# EAGLE design analog_v2 (EAGLE 6.3)
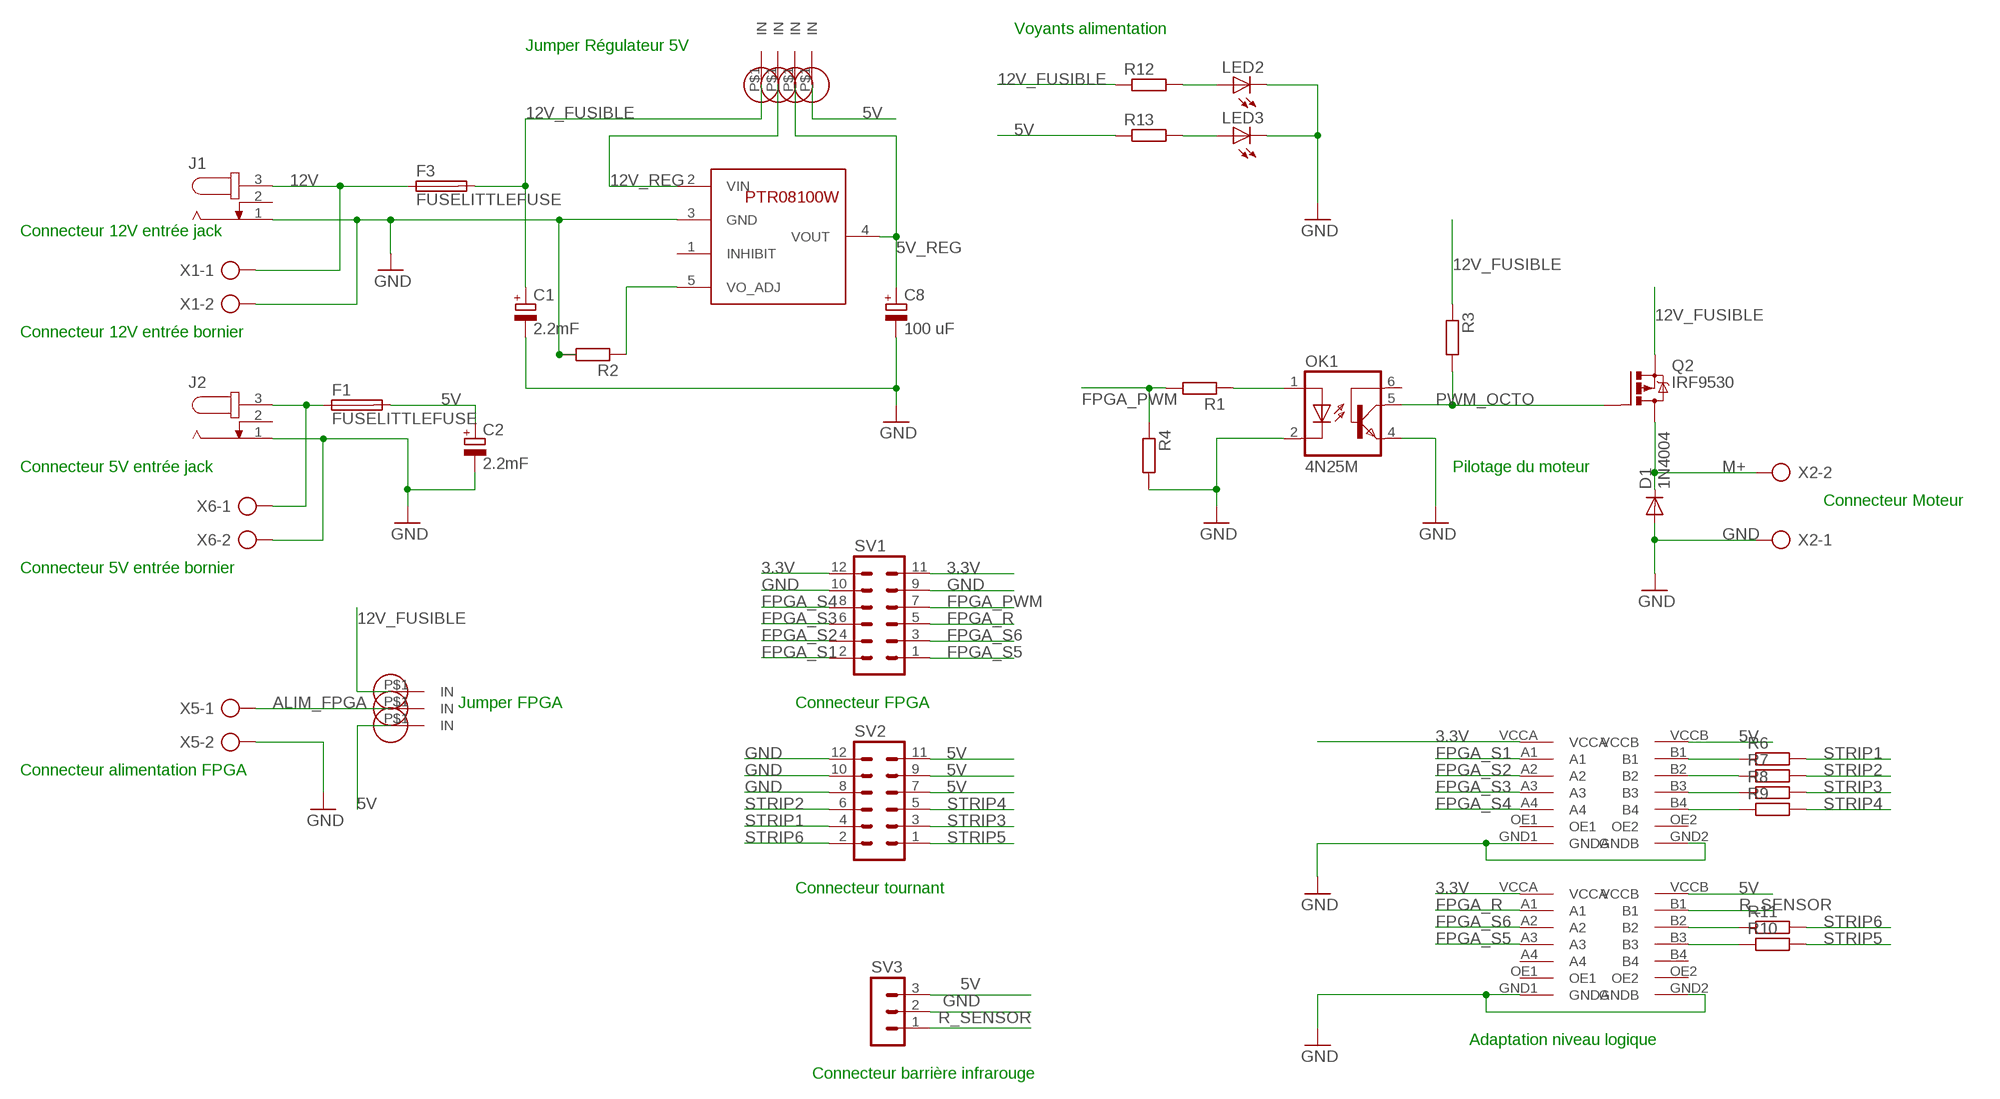
[diagram p0: schematic, sheet 1]

## Parts
C1  2.2mF  CPOL-EUE7.5-16  [E7,5-16]
C2  2.2mF  CPOL-EUE7.5-16  [E7,5-16]
C8  100 uF  CPOL-EUE2.5-7  [E2,5-7]
D1  1N4004  [DO41-10]
F1  FUSELITTLEFUSE  [LITTLEFUSE]
F3  FUSELITTLEFUSE  [LITTLEFUSE]
J1  JACK-PLUG1  [SPC4078]
J2  JACK-PLUG1  [SPC4078]
LED2  LED5MM  [LED5MM]
LED3  LED5MM  [LED5MM]
OK1  4N25M  [DIL06]
Q2  IRF9530  [TO220BV]
R1  R-EU_0207/10  [0207/10]
R2  R-EU_0207/10  [0207/10]
R3  R-EU_0207/10  [0207/10]
R4  R-EU_0207/10  [0207/10]
R6  R-EU_0207/10  [0207/10]
R7  R-EU_0207/10  [0207/10]
R8  R-EU_0207/10  [0207/10]
R9  R-EU_0207/10  [0207/10]
R10  R-EU_0207/10  [0207/10]
R11  R-EU_0207/10  [0207/10]
R12  R-EU_0207/10  [0207/10]
R13  R-EU_0207/10  [0207/10]
SV1  MA06-2  [MA06-2]
SV2  MA06-2  [MA06-2]
SV3  MA03-1  [MA03-1]
U2  PTR08100W  [PTR08100W]
U$1  TXB0104  [TXB0104]
U$2  TXB0104  [TXB0104]
U$3  JUMPER_CONNECTOR  [JUMPER_CONNECTOR]
U$4  JUMPER_CONNECTOR  [JUMPER_CONNECTOR]
U$5  JUMPER_CONNECTOR  [JUMPER_CONNECTOR]
U$6  JUMPER_CONNECTOR  [JUMPER_CONNECTOR]
U$7  JUMPER_CONNECTOR  [JUMPER_CONNECTOR]
U$10  JUMPER_CONNECTOR  [JUMPER_CONNECTOR]
U$12  JUMPER_CONNECTOR  [JUMPER_CONNECTOR]
X1  AK500/2  [AK500/2]
X2  AK500/2  [AK500/2]
X5  AK500/2  [AK500/2]
X6  AK500/2  [AK500/2]

## Nets
3.3V: SV1.11 SV1.12 U$1.VCCA U$2.VCCA
5V: C2.+ F1.2 R13.1 SV2.7 SV2.9 SV2.11 SV3.3 U$1.VCCB U$2.VCCB U$5.P$1(IN) U$10.P$1(IN)
5V_IN: F1.1 J2.3 X6.1
5V_REG: C8.+ U2.4(VOUT) U$12.P$1(IN)
12V: F3.1 J1.3 X1.1
12V_FUSIBLE: C1.+ F3.2 Q2.S R3.1 R12.1 U$3.P$1(IN) U$6.P$1(IN)
12V_REG: U2.2(VIN) U$7.P$1(IN)
ALIM_FPGA: U$4.P$1(IN) X5.1
FPGA_PWM: R1.2 R4.1 SV1.7
FPGA_R: SV1.5 U$2.A1
FPGA_S1: SV1.2 U$1.A1
FPGA_S2: SV1.4 U$1.A2
FPGA_S3: SV1.6 U$1.A3
FPGA_S4: SV1.8 U$1.A4
FPGA_S5: SV1.1 U$2.A3
FPGA_S6: SV1.3 U$2.A2
GND: C1.- C2.- C8.- D1.A J1.1 J2.1 LED2.K(C) LED3.K(C) OK1.2(C) OK1.4(EMI) R2.2 R4.2 SV1.9 SV1.10 SV2.8 SV2.10 SV2.12 SV3.2 U2.3(GND) U$1.GND1(GNDA) U$1.GND2(GNDB) U$2.GND1(GNDA) U$2.GND2(GNDB) X1.2 X2.1 X5.2 X6.2
M+: D1.C Q2.D X2.2
PWM_OCTO: OK1.5(COL) Q2.G R3.2
R_SENSOR: SV3.1 U$2.B1
R_STRIP_1: R6.1 U$1.B1
R_STRIP_2: R7.1 U$1.B2
R_STRIP_3: R8.1 U$1.B3
R_STRIP_4: R9.1 U$1.B4
R_STRIP_5: R10.1 U$2.B3
R_STRIP_6: R11.1 U$2.B2
RES_LED_5V: LED3.A R13.2
RES_LED_12V: LED2.A R12.2
RES_OCTO: OK1.1(A) R1.1
STRIP1: R6.2 SV2.4
STRIP2: R7.2 SV2.6
STRIP3: R8.2 SV2.3
STRIP4: R9.2 SV2.5
STRIP5: R10.2 SV2.1
STRIP6: R11.2 SV2.2
VO_ADJ: R2.1 U2.5(VO_ADJ)
Unconnected: J1.2 J2.2 OK1.6(BAS) U2.1(INHIBIT) U$1.OE1 U$1.OE2 U$2.A4 U$2.B4 U$2.OE1 U$2.OE2

## Notes on the sheet
- Voyants alimentation
- Jumper Régulateur 5V
- Connecteur 12V entrée jack
- Connecteur 12V entrée bornier
- Connecteur 5V entrée jack | Pilotage du moteur
- Connecteur Moteur
- Connecteur 5V entrée bornier
- Jumper FPGA | Connecteur FPGA
- Connecteur alimentation FPGA
- Connecteur tournant
- Adaptation niveau logique
- Connecteur barrière infrarouge

## Library data of the parts
C1 C2 C8 = rcl:CPOL-EU: POLARIZED CAPACITOR, European symbol
D1 = diode:1N4004: DIODE general purpose rectifier, 1 A
F1 F3 = fuse:FUSE: Fuse; OC_FARNELL: unknown; OC_NEWARK: unknown
J1 J2 = con-jack:JACK-PLUG: DC POWER JACK Power Jack, DC, Right Angle, Through Hole, Rated 5A at 16VDC, PC Terminals Distributor: Farnell (www.Farnell.de) Drawing: 84N1161.pdf / 84N1162.pdf Manufacturer: SPC Technology (www.spctechnology.com) Type: SPC4077 / SPC 4078; OC_FARNELL: unknown; OC_NEWARK: unknown
LED2 LED3 = led:LED: LED OSRAM: - CHIPLED LG R971, LG N971, LY N971, LG Q971, LY Q971, LO R971, LY R971 LH N974, LH R974 LS Q976, LO Q976, LY Q976 LO Q996 - Hyper CHIPLED LW Q18S LB Q993, LB Q99A, LB R99A - SideLED LS A670, LO A670, LY A670, LG A670, LP A670 LB A673, LV A673, LT A673, LW A673 LH A674 LY A675 LS A676, LA A676, LO A676, LY A676, LW A676 LS A679, LY A679, LG A679 - Hyper Micro SIDELED® LS Y876, LA Y876, LO Y876, LY Y876 LT Y87S - SmartLED LW L88C, LW L88S LB L89C, LB L89S, LG L890 LS L89K, LO L89K, LY L89K LS L896, LA L896, LO L896, LY L896 - TOPLED LS T670, LO T670, LY T670, LG T670, LP T670 LSG T670, LSP T670, LSY T670, LOP T670, LYG T670 LG T671, LOG T671, LSG T671 LB T673, LV T673, LT T673, LW T673 LH T674 LS T676, LA T676, LO T676, LY T676, LB T676, LH T676, LSB T676, LW T676 LB T67C, LV T67C, LT T67C, LS T67K, LO T67K, LY T67K, LW E67C LS E67B, LA E67B, LO E67B, LY E67B, LB E67C, LV E67C, LT E67C LW T67C LS T679, LY T679, LG T679 LS T770, LO T770, LY T770, LG T770, LP T770 LB T773, LV T773, LT T773, LW T773 LH T774 LS E675, LA E675, LY E675, LS T675 LS T776, LA T776, LO T776, LY T776, LB T776 LHGB T686 LT T68C, LB T68C - Hyper Mini TOPLED® LB M676 - Mini TOPLED Santana® LG M470 LS M47K, LO M47K, LY M47K Source: http://www.osram.convergy.de LUXEON: - LUMILED® LXK2-PW12-R00, LXK2-PW12-S00, LXK2-PW14-U00, LXK2-PW14-V00 LXK2-PM12-R00, LXK2-PM12-S00, LXK2-PM14-U00 LXK2-PE12-Q00, LXK2-PE12-R00, LXK2-PE12-S00, LXK2-PE14-T00, LXK2-PE14-U00 LXK2-PB12-K00, LXK2-PB12-L00, LXK2-PB12-M00, LXK2-PB14-N00, LXK2-PB14-P00, LXK2-PB14-Q00 LXK2-PR12-L00, LXK2-PR12-M00, LXK2-PR14-Q00, LXK2-PR14-R00 LXK2-PD12-Q00, LXK2-PD12-R00, LXK2-PD12-S00 LXK2-PH12-R00, LXK2-PH12-S00 LXK2-PL12-P00, LXK2-PL12-Q00, LXK2-PL12-R00 Source: www.luxeon.com KINGBRIGHT: KA-3528ASYC Source: www.kingbright.com
OK1 = optocoupler:4N*?M: General Purpose 6-Pin Phototransistor Optocouplers Source: http://www.fairchildsemi.com/ds/4N/4N35-M.pdf; MPN: 4N25-M; OC_FARNELL: 1021349; OC_NEWARK: 98K9084
Q2 = transistor-power:IRF9530: P-CHANNEL HEXFET POWER-MOS-FET Source: http://www.irf.com/product-info/datasheets/data/irf9530.pdf
R1-R4 R6-R13 = rcl:R-EU_: RESISTOR, European symbol
SV1 SV2 = con-lstb:MA06-2: PIN HEADER; OC_FARNELL: unknown; OC_NEWARK: unknown
SV3 = con-lstb:MA03-1: PIN HEADER; OC_FARNELL: unknown; OC_NEWARK: unknown
U2 = perso:PTR08100W
U$1 U$2 = perso:TXB0104
U$3-U$7 U$10 U$12 = perso:JUMPER_CONNECTOR
X1 X2 X5 X6 = con-ptr500:AK500/2: CONNECTOR; OC_FARNELL: unknown; OC_NEWARK: unknown

## Board
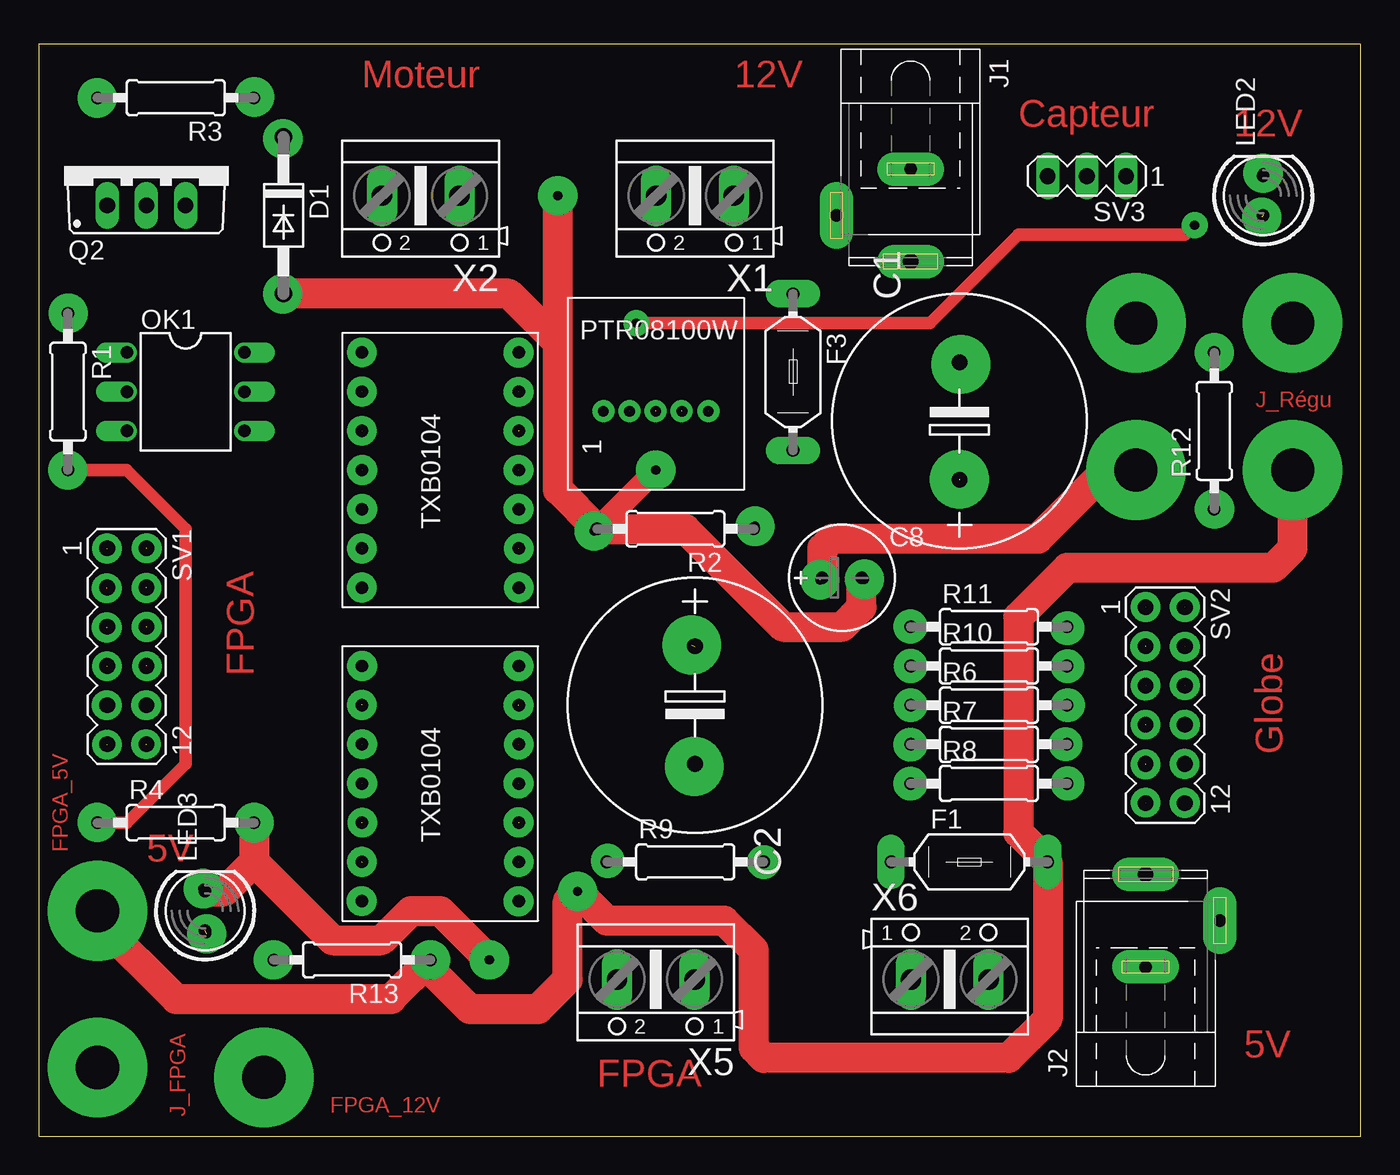
[diagram p1: board, top side]
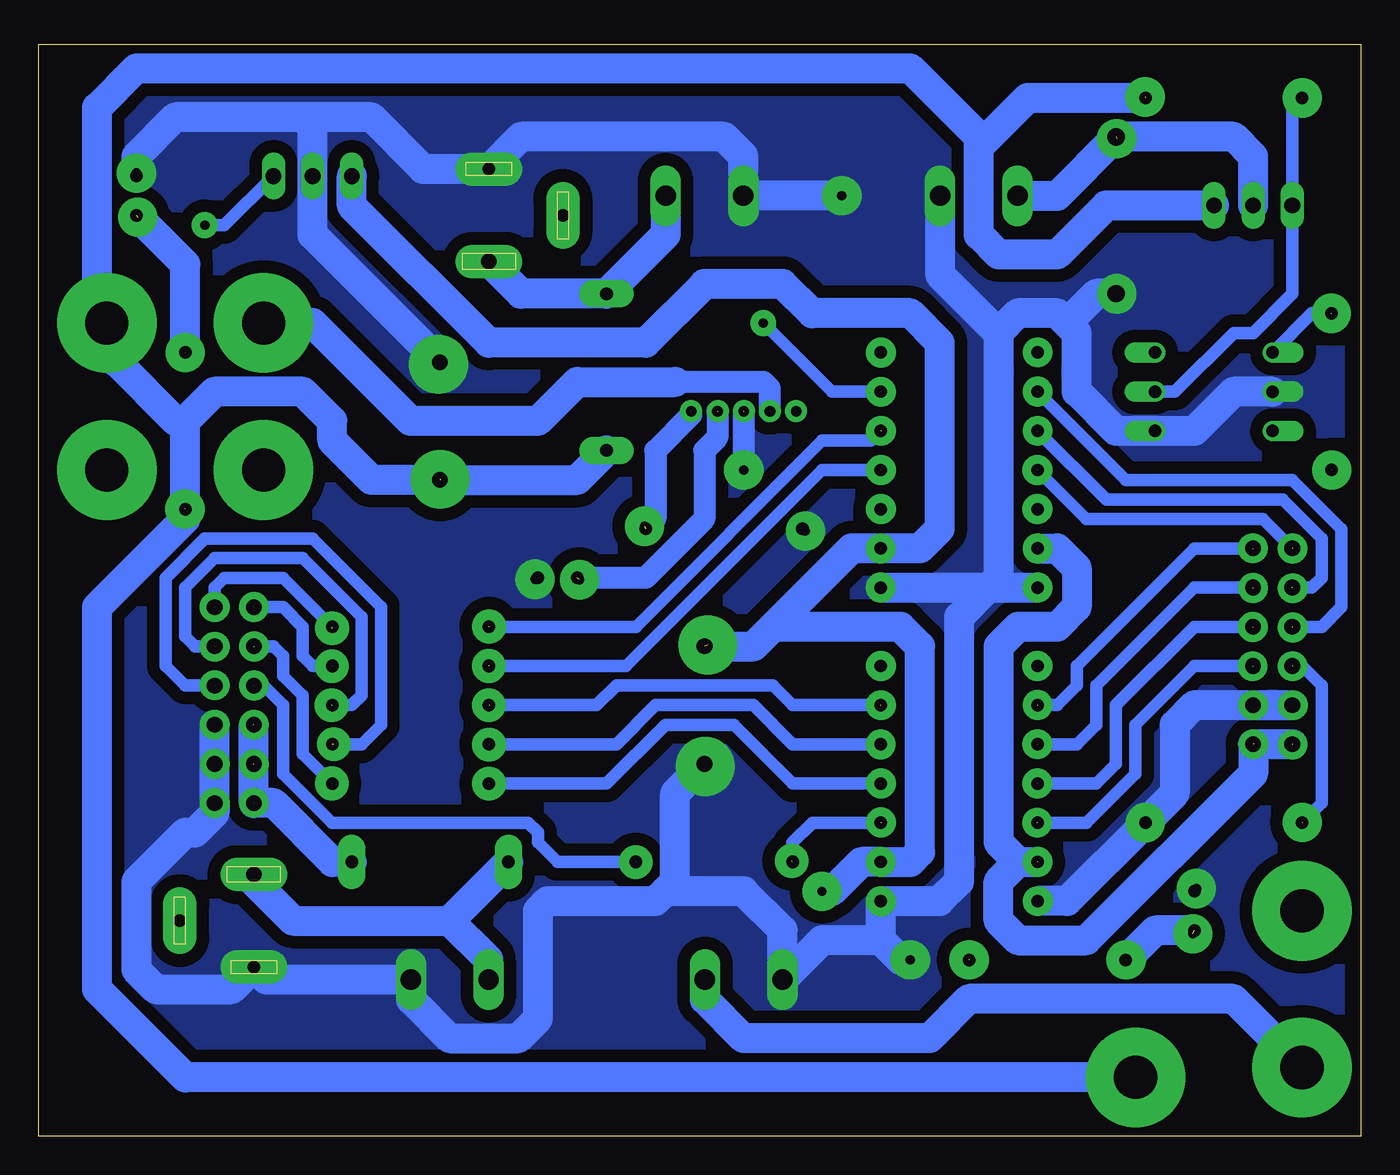
[diagram p2: board, bottom side, seen from below]

Size 85.7 x 70.79 mm. Coordinates in mm from the lower left corner, seen from the top.
Outline: 0,0 85.7,0 85.7,70.79 0,70.79 0,0
Copper layers (1*16): Top 0.035mm / dielectric 1.5mm / Bottom 0.035mm
Design rules "default": minimum track width 10mil, minimum drill 24mil, track to track 8mil, track to pad 8mil, pad to pad 8mil, via to via 8mil, smd to smd 8mil, copper to edge 40mil, drill to drill 8mil, minimum pad ring 10mil, minimum via ring 8mil, stop-mask expansion 4mil, vias tented up to drill 0mil, thermal gap 10mil

### Footprints (pad centres in the part's own frame; a part is rotated, then mirrored left to right if it is on the bottom)
E7,5-16 = drill 1.016 pad 3.15: + -3.81,0 | drill 1.016 pad 3.15 octagon: - 3.81,0
E2,5-7 = drill 0.813 pad 1.6: + -1.27,0 | drill 0.813 pad 1.6 octagon: - 1.27,0
DO41-10 = drill 1.118: A 5.08,0; C -5.08,0
LITTLEFUSE = drill 0.813 pad 1.778 long: 1 -5.08,0; 2 5.08,0
SPC4078 = drill 0.8 pad 2.184 long: 1 -3,0; 2 0,-4.8 | drill 1 pad 2.184 long: 3 3,0
LED5MM = drill 0.813 octagon: A -1.27,0; K 1.27,0
DIL06 = drill 0.813 offset: 1 -2.54,-3.81; 2 0,-3.81; 3 2.54,-3.81; 4 2.54,3.81; 5 0,3.81; 6 -2.54,3.81
TO220BV = drill 1.016 long: D 0,-2.54; G -2.54,-2.54; S 2.54,-2.54
0207/10 = drill 0.813 octagon: 1 -5.08,0; 2 5.08,0
MA06-2 = drill 1.016 octagon: 1 -6.35,-1.27; 2 -6.35,1.27; 3 -3.81,-1.27; 4 -3.81,1.27; 5 -1.27,-1.27; 6 -1.27,1.27; 7 1.27,-1.27; 8 1.27,1.27; 9 3.81,-1.27; 10 3.81,1.27; 11 6.35,-1.27; 12 6.35,1.27
MA03-1 = drill 1.016 long: 1 -2.54,0; 2 0,0; 3 2.54,0
PTR08100W = drill 0.7: 1 0,-3.4; 2 0,-1.7; 3 0,0; 4 0,1.7; 5 0,3.4
TXB0104 = drill 0.8: A1 -5.08,5.08; A2 -5.08,2.54; A3 -5.08,0; A4 -5.08,-2.54; B1 5.08,5.08; B2 5.08,2.54; B3 5.08,0; B4 5.08,-2.54; GND1 -5.08,-7.62; GND2 5.08,-7.62; OE1 -5.08,7.62; OE2 5.08,7.62; VCCA -5.08,-5.08; VCCB 5.08,-5.08
JUMPER_CONNECTOR = drill 2.8 pad 6.452: P$1 0,0
AK500/2 = drill 1.321 long: 1 -2.515,0; 2 2.515,0

### Placement (x,y rotation side)
C1  59.69,46.36 90 top
C2  42.55,27.94 270 top
C8  52.07,36.2 0 top
D1  15.88,59.69 270 top
F1  60.32,17.78 0 top
F3  48.89,49.53 270 top
J1  56.52,59.69 270 top
J2  71.75,13.97 90 top
LED2  79.38,60.96 90 top
LED3  10.79,14.61 90 top
OK1  9.53,48.26 270 top
Q2  6.99,62.87 0 top
R1  1.91,48.26 270 top
R2  41.27,39.37 180 top
R3  8.89,67.31 180 top
R4  8.89,20.32 0 top
R6  61.59,27.94 0 top
R7  61.59,25.4 0 top
R8  61.59,22.86 0 top
R9  41.91,17.78 0 top
R10  61.59,30.48 0 top
R11  61.59,33.02 0 top
R12  76.2,45.72 90 top
R13  20.32,11.43 180 top
SV1  5.71,31.75 270 top
SV2  73.03,27.94 270 top
SV3  67.94,62.23 180 top
U2  40,46.99 270 top
U$1  26.04,22.86 0 top
U$2  26.04,43.18 0 top
U$3  14.61,3.81 0 top
U$4  3.81,4.45 0 top
U$5  3.81,14.61 0 top
U$6  81.28,52.71 0 top
U$7  71.12,52.71 0 top
U$10  81.28,43.18 0 top
U$12  71.12,43.18 0 top
X1  42.55,60.96 180 top
X2  24.77,60.96 180 top
X5  40,10.16 180 top
X6  59.05,10.16 0 top

### Tracks (layer width: path | path; a pad name or v marks a point on that pad's centre or on a via)
3.3V  (via drill 0.6 pad 1.93)  (4 unrouted)
  Bottom 1.93: 22.22,17.78 23.49,16.51 23.49,13.97 22.22,12.7 17.78,12.7 6.99,23.49 SV1.12 SV1.11 | 22.22,17.78 U$1.VCCA | U$2.VCCA 19.68,38.1 18.41,36.83 18.41,34.29 19.68,33.02 22.22,33.02 23.49,31.75 23.49,19.05 22.22,17.78
  other vias: 20.95,17.77 20.96,38.1 4.43,25.38 6.96,25.41
5V  (via drill 0.6 pad 1.93, 0.6 pad 2.54, 0.6 pad 3.81)  (7 unrouted)
  Top 1.93: U$5.P$1 3.81,13.97 8.89,8.89 22.86,8.89 R13.1 25.4,10.79 27.94,8.26 32.38,8.26 34.29,10.16 34.29,15.24 v34.92,15.88 36.83,13.97 44.45,13.97 46.35,12.07 46.35,5.71 46.99,5.08 62.86,5.08 65.41,7.62 F1.2 63.5,19.68 63.5,33.66 66.67,36.83 80.01,36.83 81.28,38.1 U$10.P$1
  Bottom 1.93: C2.+ 39.37,31.75 38.1,33.02 | 38.1,33.02 33.02,38.1 U$2.VCCB 28.57,38.1 27.3,39.37 27.3,51.44 29.21,53.34 35.56,53.34 37.46,55.25 42.55,55.25 46.35,51.44 56.52,51.44 65.41,60.33 SV3.3 | SV2.7 SV2.9 SV2.11 70.48,21.59 66.67,17.78 F1.2 | v34.92,15.88 34.29,15.88 32.38,17.78 U$1.VCCB 29.21,17.78 28.57,18.41 28.57,31.75 29.84,33.02 38.1,33.02
  other vias: 25.39,11.43 31.12,17.78 42.33,31.83 31.12,38.09 71.75,21.62 71.75,24.11 71.75,26.67
5V_IN
  Bottom 1.93: J2.3 71.75,16.51 69.22,13.97 59.05,13.97 | 59.05,13.97 F1.1 | X6.1 56.54,11.46 59.05,13.97
5V_REG  (via drill 0.6 pad 1.42, 0.6 pad 2.54)  (2 unrouted)
  Top 1.93: C8.+ 50.8,38.1 51.44,38.73 64.77,38.73 69.22,43.18 U$12.P$1
  Bottom 1.422: U2.4 41.7,45.29 42.55,44.45 42.55,40.01 46.35,36.2 C8.+
  other vias: 41.68,47.01 50.65,36.07
12V
  Bottom 1.93: X1.1 45.06,58.45 F3.1 54.44,54.61 J1.3
12V_FUSIBLE  (via drill 0.6 pad 2.54, 0.6 pad 3.81)  (3 unrouted)
  Bottom 1.93: F3.2 50.8,42.55 C1.+ 64.14,42.55 66.67,45.09 66.67,46.36 68.58,48.26 74.3,48.26 76.2,46.36 | Q2.S 16.51,60.33 19.68,57.15 23.49,57.15 24.77,58.42 24.77,64.14 | 24.77,64.14 21.59,67.31 R3.1 | 24.77,64.14 24.77,64.77 29.21,69.22 79.38,69.22 81.91,66.67 81.91,53.34 U$6.P$1 80.64,52.07 80.64,50.16 76.83,46.36 76.2,46.36 | 76.2,46.36 R12.1 76.2,40.01 81.91,34.29 81.91,9.53 76.2,3.81 U$3.P$1
  other vias: 59.68,42.58 76.22,40.66 13.99,67.37
12V_REG  (via drill 0.6 pad 1.42)  (1 unrouted)
  Bottom 1.422: U2.2 38.3,48.47 38.73,48.9 44.45,48.9
  Bottom 1.93: 44.45,48.9 50.8,48.9 53.34,46.36 61.59,46.36 67.94,52.71 U$7.P$1
  other vias: 38.32,46.99
ALIM_FPGA
  Bottom 1.93: X5.1 42.52,8.87 40,6.35 27.94,6.35 25.4,8.89 8.26,8.89 U$4.P$1
FPGA_PWM  (via drill 0.6 pad 1.93, 0.6 pad 2.54)  (3 unrouted)
  Top 0.813: R1.2 5.71,43.18 9.53,39.37 9.53,24.13 5.71,20.32 R4.1
  Bottom 0.813: SV1.7 3.81,30.48 2.54,29.21 2.54,21.6 v3.8,20.33
  other vias: 1.89,43.17 4.43,30.46
FPGA_R  (via drill 0.6 pad 1.93)  (2 unrouted)
  Bottom 0.813: U$2.A1 15.24,42.55 4.44,42.55 1.27,39.37 1.27,34.29 2.54,33.02 SV1.5
  other vias: 20.96,48.27 4.42,32.98
FPGA_S1  (via drill 0.6 pad 1.93)  (2 unrouted)
  Bottom 0.813: U$1.A1 19.68,27.94 18.41,29.21 18.41,30.48 10.79,38.1 SV1.2
  other vias: 20.95,27.95 7,38.11
FPGA_S2  (via drill 0.6 pad 1.93)  (2 unrouted)
  Bottom 0.813: U$1.A2 18.41,25.4 17.14,26.67 17.14,29.21 10.79,35.56 SV1.4
  other vias: 20.97,25.41 7,35.54
FPGA_S3  (via drill 0.6 pad 1.93)  (2 unrouted)
  Bottom 0.813: U$1.A3 17.14,22.86 15.88,24.13 15.88,27.94 10.79,33.02 SV1.6
  other vias: 20.98,22.87 7,33
FPGA_S4  (via drill 0.6 pad 1.93)  (2 unrouted)
  Bottom 0.813: U$1.A4 17.78,20.32 14.61,23.49 14.61,26.67 10.79,30.48 SV1.8
  other vias: 20.98,20.32 7.02,30.46
FPGA_S5  (via drill 0.6 pad 1.93)  (2 unrouted)
  Bottom 0.813: U$2.A3 17.78,40.01 6.35,40.01 SV1.1
  other vias: 20.96,43.18 4.43,38.08
FPGA_S6  (via drill 0.6 pad 1.93)  (2 unrouted)
  Bottom 0.813: U$2.A2 16.51,41.28 5.08,41.28 2.54,38.73 2.54,36.2 3.17,35.56 SV1.3
  other vias: 20.96,45.72 4.42,35.52
GND  (via drill 0.6 pad 1.42, 0.6 pad 1.93, 0.6 pad 2.54, 0.6 pad 3.81)  (1 unrouted)
  Top 1.422: v40,43.18 R2.2
  Top 1.93: 33.66,51.44 33.66,41.91 R2.2 41.91,39.37 48.26,33.02 52.07,33.02 53.34,34.29 C8.- | 33.66,51.44 30.48,54.61 D1.A | v29.21,11.43 26.04,14.61 24.13,14.61 22.22,12.7 19.05,12.7 13.97,17.78 | 33.66,51.44 v33.66,60.96 | R4.2 13.97,17.78 | LED3.K 12.07,15.88 13.97,17.78
  Bottom 1.422: U2.3 v40,43.18
  Bottom 1.93: OK1.2 8.26,48.26 10.79,45.72 OK1.4 15.88,45.72 18.41,48.26 18.41,52.07 19.05,52.71 | 19.05,52.71 19.68,53.34 22.22,53.34 23.49,52.07 | 22.22,35.56 U$2.GND1 24.13,35.56 | D1.A 17.14,54.61 19.05,52.71 | X2.1 27.28,55.86 23.49,52.07 | X1.2 40.03,63.53 41.27,64.77 54.44,64.77 J1.1 60.78,62.69 64.14,66.04 68.58,66.04 | SV2.8 SV2.10 SV2.12 74.3,20.95 75.56,19.68 76.2,19.68 79.38,16.51 79.38,10.79 78.11,9.53 73.2,9.53 J2.1 70.94,10.16 X6.2 61.57,8.87 59.05,6.35 54.61,6.35 53.34,7.62 53.34,14.61 52.7,15.24 45.72,15.24 45.09,15.88 | 45.09,15.88 44.45,16.51 44.45,22.22 C2.- | U$2.GND2 24.13,35.56 | 24.13,35.56 26.04,33.66 26.04,16.51 27.3,15.24 U$1.GND2 31.12,12.7 | 23.49,52.07 23.49,36.2 24.13,35.56 | 40,60.94 X1.2 | 45.09,15.88 40,15.88 37.49,13.36 X5.2 37.46,10.16 34.92,12.7 31.12,12.7 | v29.21,11.43 29.84,11.43 31.12,12.7 | 68.58,66.04 76.83,66.04 79.38,63.5 LED2.K | v33.66,60.96 X1.2 | 68.58,66.04 67.94,65.41 SV3.2 67.94,58.42 C1.- | U$1.GND1 19.05,15.24 R4.2 12.07,22.22 12.07,26.67 10.79,27.94 SV1.10 SV1.9
  other vias: 13.98,20.33 10.66,16.04 20.93,15.24 20.95,35.56 31.12,35.58 15.82,54.59 36.01,39.23 39.99,47.01 53.53,36.1 42.5,23.97 59.77,50.03 79.36,62.43 74.28,21.61 74.27,24.14 74.29,26.67 31.11,15.23 6.97,27.93 4.42,27.93
  pour Bottom (isolate 0.813, no thermals): 0,0 0,71.12 85.09,71.12 85.09,0
M+  (via drill 0.6 pad 2.54)  (1 unrouted)
  Bottom 1.93: X2.2 19.68,60.96 D1.C 8.26,64.77 6.99,63.5 Q2.D
  other vias: 15.83,64.66
N$40  (via drill 0.6 pad 1.93)
  other vias: 20.96,30.47
N$53  (via drill 0.6 pad 1.93)
  other vias: 31.11,30.47
N$57  (via drill 0.6 pad 1.93)
  other vias: 31.1,40.65
N$61  (via drill 0.6 pad 1.93)
  other vias: 31.12,50.8
N$62  (via drill 0.6 pad 1.93)
  other vias: 20.96,50.8
N$66  (via drill 0.6 pad 1.93)
  other vias: 20.97,40.65
N$101  (via drill 0.6 pad 1.42)
  other vias: 36.61,47
PWM_OCTO  (via drill 0.6 pad 2.54)  (1 unrouted)
  Bottom 0.813: OK1.5 12.07,48.26 8.26,52.07 6.99,52.07 4.44,54.61 Q2.G 4.44,66.67 R3.2
  other vias: 3.79,67.3
R_SENSOR  (via drill 0.6 pad 1.68, 0.6 pad 1.93)  (1 unrouted)
  Top 0.813: v38.73,52.71 57.78,52.71 63.5,58.42 74.3,58.42 v74.93,59.05
  Bottom 0.813: U$2.B1 34.29,48.26 v38.73,52.71 | v74.93,59.05 73.66,59.05 SV3.1
  other vias: 31.12,48.25
R_STRIP_1  (via drill 0.6 pad 1.93, 0.6 pad 2.18)  (2 unrouted)
  Bottom 0.813: U$1.B1 36.83,27.94 38.1,29.21 48.26,29.21 49.53,27.94 R6.1
  other vias: 31.12,27.93 56.52,27.93
R_STRIP_2  (via drill 0.6 pad 1.93, 0.6 pad 2.18)  (2 unrouted)
  Bottom 0.813: U$1.B2 36.83,25.4 39.37,27.94 45.72,27.94 48.26,25.4 R7.1
  other vias: 31.12,25.39 56.51,25.39
R_STRIP_3  (via drill 0.6 pad 1.93, 0.6 pad 2.18)  (2 unrouted)
  Bottom 0.813: U$1.B3 36.83,22.86 40.64,26.67 45.09,26.67 48.89,22.86 R8.1
  other vias: 31.12,22.86 56.51,22.86
R_STRIP_4  (via drill 0.6 pad 1.93, 0.6 pad 2.18)  (2 unrouted)
  Bottom 0.813: U$1.B4 35.56,20.32 36.83,19.05 R9.1
  other vias: 31.11,20.34 36.89,17.85
R_STRIP_5  (via drill 0.6 pad 1.93, 0.6 pad 2.18)  (2 unrouted)
  Bottom 0.813: U$2.B3 34.92,43.18 47.62,30.48 R10.1
  other vias: 31.12,43.18 56.53,30.47
R_STRIP_6  (via drill 0.6 pad 1.93, 0.6 pad 2.18)  (2 unrouted)
  Bottom 0.813: R11.1 46.99,33.02 34.92,45.09 31.75,45.09 U$2.B2
  other vias: 56.5,33.04 31.11,45.72
RES_LED_5V  (via drill 0.6 pad 2.54)  (2 unrouted)
  Bottom 1.93: LED3.A 13.34,13.34 R13.2
  other vias: 10.89,13.13 15.22,11.43
RES_LED_12V  (via drill 0.6 pad 2.54)  (2 unrouted)
  Bottom 1.93: R12.2 76.2,56.52 LED2.A
  other vias: 79.28,59.57 76.19,50.8
RES_OCTO  (via drill 0.6 pad 2.54)  (1 unrouted)
  Bottom 0.813: R1.1 3.17,53.34 OK1.1
  other vias: 1.92,53.33
STRIP1  (via drill 0.6 pad 1.93, 0.6 pad 2.18)  (2 unrouted)
  Bottom 0.813: R6.2 65.41,27.94 64.77,28.57 64.77,33.66 68.58,37.47 74.3,37.47 76.2,35.56 76.2,32.38 75.56,31.75 SV2.4
  other vias: 66.71,27.94 74.3,31.73
STRIP2  (via drill 0.6 pad 1.93, 0.6 pad 2.18)  (2 unrouted)
  Bottom 0.813: R7.2 64.77,25.4 63.5,26.67 63.5,34.29 67.94,38.73 74.93,38.73 77.47,36.2 77.47,30.48 76.2,29.21 SV2.6
  other vias: 66.57,25.41 74.28,29.23
STRIP3  (via drill 0.6 pad 1.93, 0.6 pad 2.18)  (2 unrouted)
  Bottom 0.813: R8.2 68.58,24.76 68.58,28.57 69.85,29.84 69.85,31.11 70.48,31.75 SV2.3
  other vias: 66.69,22.86 71.73,31.74
STRIP4  (via drill 0.6 pad 1.93, 0.6 pad 2.18)  (2 unrouted)
  Bottom 0.813: v46.99,17.78 52.07,17.78 53.34,19.05 53.34,19.68 53.98,20.32 66.67,20.32 69.85,23.49 69.85,27.94 71.12,29.21 SV2.5
  other vias: 71.75,29.21
STRIP5  (via drill 0.6 pad 1.93, 0.6 pad 2.18)  (2 unrouted)
  Bottom 0.813: R10.2 67.94,30.48 68.58,31.11 68.58,33.02 69.85,34.29 SV2.1
  other vias: 66.69,30.47 71.75,34.3
STRIP6  (via drill 0.6 pad 1.93, 0.6 pad 2.18)  (2 unrouted)
  Bottom 0.813: R11.2 69.85,36.2 73.66,36.2 74.3,35.56 SV2.2
  other vias: 66.67,32.92 74.29,34.3
VO_ADJ  (via drill 0.6 pad 1.42, 0.6 pad 2.54)  (2 unrouted)
  Bottom 1.422: U2.5 43.41,46.77 45.72,44.45 45.72,40.01 R2.1
  other vias: 43.41,47 46.43,39.54

### Text on the board
Top: Moteur | 12V | Capteur | 12V | J_Régu | FPGA | Globe | FPGA_5V | 5V | 5V | FPGA_12V | FPGA | J_FPGA